# Altium project Task 6.PrjPcb
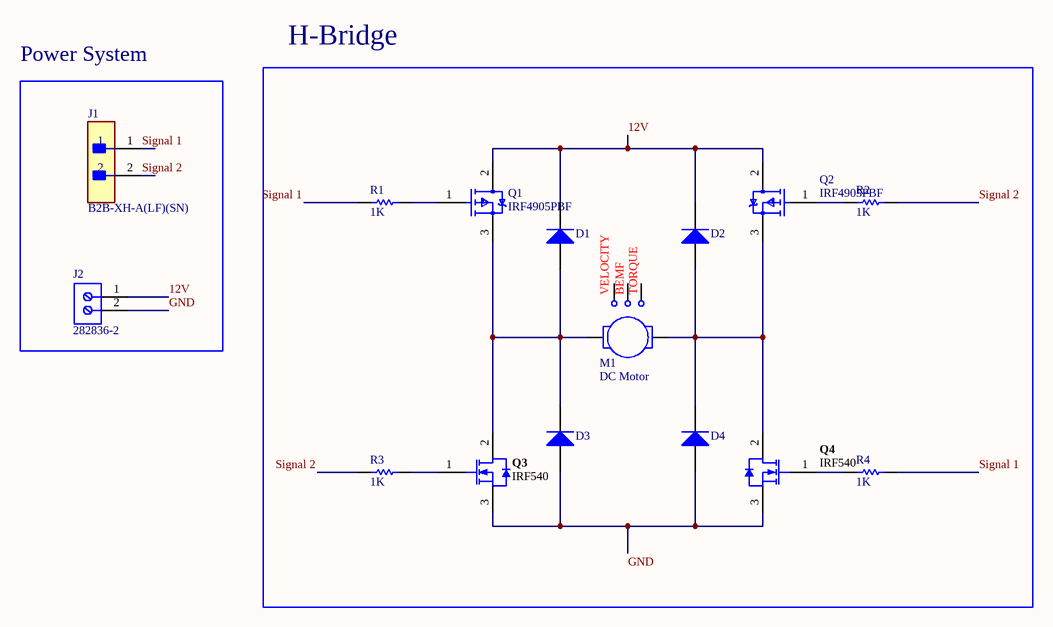
[diagram p0: Sheet1.SchDoc]
1 sheet, 15 parts. Net scope: global (net labels, ports and power ports of the same name join across sheets).
Board file: PCB1.PcbDoc

## Sheet Sheet1.SchDoc
size A; SheetNumber: 1; SheetTotal: 1

### Parts
D1  Diode  (value not drawn)
D2  Diode  (value not drawn)
D3  Diode  (value not drawn)
D4  Diode  (value not drawn)
J1  B2B-XH-A(LF)(SN)  [FP-B2B-XH-A_LF_SN-MFG]
J2  282836-2  [TECO-282836-2_V]
M1  DC Motor
Q1  IRF4905PBF  [FP-PG-TO220-3-MFG]
Q2  IRF4905PBF  [FP-PG-TO220-3-MFG]
Q3  IRF540  [VISH-TO-220AB-3_A]
Q4  IRF540  [VISH-TO-220AB-3_A]
R1  value 1K  (hidden comment: Resistor)
R2  value 1K  (hidden comment: Resistor)
R3  value 1K  (hidden comment: Resistor)
R4  value 1K  (hidden comment: Resistor)

### Blocks framed on the sheet
Power System: J1 J2
H-Bridge: D1-D4 M1 Q1-Q4 R1-R4

### Nets
12V: D1.2(K) D2.2(K) J2.1 Q1.2(DRAIN) Q2.2(DRAIN)
GND: D3.1(A) D4.1(A) J2.2 Q3.3(S) Q4.3(S)
Signal 1: J1.1 R1.1 R4.2
Signal 2: J1.2 R2.2 R3.1
NetD1_1: D1.1(A) D3.2(K) M1.1 Q1.3(SOURCE) Q3.2(D)
NetD2_1: D2.1(A) D4.2(K) M1.2 Q2.3(SOURCE) Q4.2(D)
NetQ1_1: Q1.1(GATE) R1.2
NetQ2_1: Q2.1(GATE) R2.1
NetQ3_1: Q3.1(G) R3.2
NetQ4_1: Q4.1(G) R4.1

Not connected (* = marked no-connect by the designer): M1 3 4 5

### Notes on the sheet
- (in symbol DC Motor) VELOCITY; BEMF; TORQUE

### Library data of the parts
D1-D4 = Diode: AF: 1; BV: 0; BV_MAX: 1e99; EG: 1.11; FC: 0.5; IBV: 0.001; ISR: 1e-14; MJSW: 0.33; NTUN: 30; TNOM: 27; XTI: 3; SimulationGenericComponent: True; CJO: 0; CJP: 0; CTA: 0; CTP: 0; FCS: 0.5; FV_MAX: 1e99; IKF: 0; IKR: 0; JSW: 0; JTUN: 0; JTUNSW: 0; KEG: 1; KF: 0; LEVEL: 1; N: 1; NBV: 1; NR: 1; NS: 1; PHP: 1; RS: 0; TCV: 0; TLEV: 0; TLEVC: 0; TM1: 0; TM2: 0; TPB: 0; TPHP: 0; TRS: 0; TRS2: 0; TT: 0; TTT1: 0; TTT2: 0; VJ: 1; XTITUN: 3; IS: 1e-14
J1 = CMP-2000-05888-3: CONN HEADER VERT 2POS 2.5MM; Current Rating: 3A; Voltage Rating: 250V; Number of Contacts: 2; Contact Resistance: 20mR; Wire/Cable Gauge: 22AWG; Insulation Resistance: 1GR; Connector Type: Male Pin; Packaging: Bulk; Contact Material: Brass; Lead Free: Lead Free; Orientation: Straight; Contact Plating: Tin; Max Current Rating: 3A; Termination: Solder; Fastening Type: Detent; Depth: 5.75mm; Housing Material: Polyamide; REACH SVHC: No SVHC; Series: XH; Voltage Rating (AC): 250V; Number of Positions: 2; Color: Natural; Contact Type: Male Pin; Max Voltage Rating (DC): 250V; Pitch: 2.5mm; Lead Pitch: 2.5mm; Mount: Through Hole; Max Operating Temperature: 85°C; Length: 7.4mm; Max Voltage Rating (AC): 250V; Min Operating Temperature: -25°C; Number of Rows: 1; Housing Color: White
J2 = CMP-1684-00017-1: Female Header, Pitch 5 mm, 1 x 2 Position, Height 10 mm, Tail Length 3.5 mm, Rohs, Bulk; Manufacturer: TE Connectivity; Wire Gauge: 16-30AWG; Product Training Modules: Wire-to-BoardEurostyleTerminalBlocks; Clamp Material - Plating: Brass-NickelPlated; Voltage: 300V; Mating Orientation: HorizontalwithBoard; Current: 13.5A; Pitch: 0.197"(5.00mm); Screw Thread: M3; 3D Model: 282836-2.pdf; Other Names: 5ULV-02B / A98076; Dynamic Catalog: BuchananSeries; Number of Levels: 1; Torque - Screw: 0.68Nm(6Lb-In); Featured Product: EurostyleTerminalBlockConnectors; Positions Per Level: 2; Wire Termination: Screw-RisingCageClamp; Datasheet URL: http://www.te.com.cn/commerce/DocumentDelivery/DDEController?Action=showdoc&DocId=Catalog+Section%7F1308389_EUROSTYLE_TERMINAL_BLOCKS%7F0607%7Fpdf%7FEnglish%7FENG_CS_1308389_EUROSTYLE_TERMINAL_BLOCKS_0607.pdf%7F282836-2; Color: Green; Family: TerminalBlocks-WiretoBoard; RoHS Information: 282836-2StatementofCompliance; Standard Package: 300; Contact Material - Plating: Brass-TinPlated; Manufacturer URL: http://www.te.com; Housing Material: Polyamide(PA66),Nylon6/6; Features: Interlocking(Side); Package Description: Female Header, Pitch 5 mm, 1 x 2 Position, Height 10 mm, Tail Length 3.5 mm; Mounting Type: ThroughHole; Package Reference: THD; Packaging: Bulk; Series: Buchanan; Category: Connectors,Interconnects; Screw Material - Plating: Brass-NickelPlated
M1 = DC Motor: LA: 1.5M; RA: 0.5; KE: 0.05; JM: 250U; BM: 0.1M; TL: 0; SimulationGenericComponent: True; KT: 0.05
Q1 Q2 = CMP-32901-000200-1: MOSFET P-CH 55V 74A TO-220AB; Drain to Source Resistance: 20mR; Input Capacitance: 3.4nF; Max Dual Supply Voltage: -55V; Power Dissipation: 200W; Turn-On Delay Time: 18ns; Element Configuration: Single; Threshold Voltage: -4V; Gate to Source Voltage (Vgs): 20V; Turn-Off Delay Time: 61ns; Number of Pins: 3; Packaging: Rail/Tube; RoHS Compliant: Yes; REACH SVHC: No SVHC; Halogen Free: Halogen Free; Max Power Dissipation: 200W; Drain to Source Breakdown Voltage: -55V; Length: 0.414inch; Drain to Source Voltage (Vdss): -55V; Height: 0.6inch; Case/Package: TO-220; Width: 0.185inch; Continuous Drain Current (ID): 74A; Mount: Through Hole; Min Operating Temperature: -55°C; Lead Free: Lead Free; Max Operating Temperature: 175°C; Rds On Max: 20mR
Q3 Q4 = CMP-2000-06461-1: Power MOSFET, 100 VDS, -55 to 175 degC, 3-Pin TO-220AB, RoHS, Tube; Manufacturer: Vishay; Typical Turn-Off Delay Time: 53ns; Channel Mode: Enhancement; Unit Weight: 0.211644oz; Transistor Type: 1N-Channel; Vgs - Gate-Source Voltage: 20V; Transistor Polarity: N-Channel; Vds - Drain-Source Breakdown Voltage: 100V; Configuration: Single; Number of Channels: 1Channel; Pd - Power Dissipation: 150W; Brand: VishaySemiconductors; Rds On - Drain-Source Resistance: 77mOhms; Id - Continuous Drain Current: 28A; Rise Time: 44ns; Fall Time: 43ns; Typical Turn-On Delay Time: 11ns; &lt;PCN&gt;: http://www.mouser.com/PCN/Vishay_SIL_0182015.pdf; Maximum Operating Temperature: +175C; Product Category: MOSFET; Datasheet URL: http://www.vishay.com/docs/91021/91021.pdf; Length: 10.51mm; Height: 9.01mm; Factory Pack Quantity: 50; Width: 4.7mm; Packaging: Tube; Package Reference: TO-220AB-3; Package / Case: TO-220-3; Mounting Style: ThroughHole; Manufacturer URL: http://www.vishay.com/; Mounting Technology: ThroughHole; Package URL: http://www.vishay.com/docs/71195/to220ab.pdf; RoHS: NoRoHSVersionAvailable; Technology: Si; Minimum Operating Temperature: -55C; Package Description: 3-Pin Flange Mount, Body 10.275 x 4.45 mm, Pitch 2.54 mm; Datasheet Version: Rev. B, 03/2011
R1-R4 = Resistor: TC1: 0; SimulationGenericComponent: True; TC2: 0